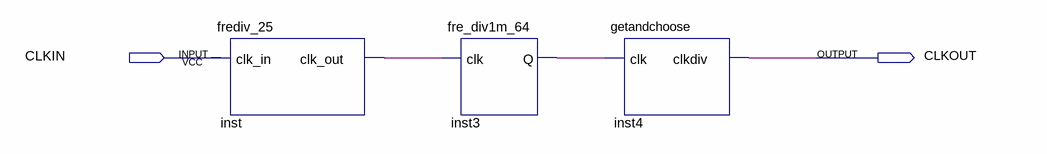
[diagram p0: schematic sheet]
// Quartus schematic div10m.bdf as structural Verilog: 3 symbols, 2 pins
module div10m (
  input  CLKIN,
  output CLKOUT
);

  wire inst3_q, inst_clk_out;

  frediv_25 inst (.clk_in(CLKIN), .clk_out(inst_clk_out));
  fre_div1m_64 inst3 (.clk(inst_clk_out), .Q(inst3_q));
  getandchoose inst4 (.clk(inst3_q), .clkdiv(CLKOUT));
endmodule
